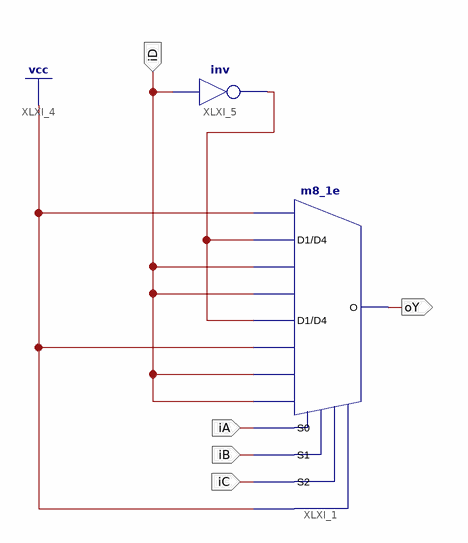
[diagram p0: schematic sheet 1]
// Xilinx ISE schematic mux8na1_sch.sch (spartan3a) as structural Verilog: 2 symbols, 5 ports
module mux8na1_sch (
  input  iD,
  input  iA,
  input  iB,
  input  iC,
  output oY
);

  wire XLXN_3;

  m8_1e XLXI_1 (
    .D0(1'b1), .D1(XLXN_3), .D2(iD), .D3(iD), .D4(XLXN_3), .D5(1'b1), .D6(iD), .D7(iD), .E(1'b1), .S0(iA),
    .S1(iB), .S2(iC), .O(oY));
  not XLXI_5 (XLXN_3, iD);
endmodule
